# Altium schematic sheet 02_stm32_power.SchDoc: KART : STM32 POWER
size A4; DrawnBy: JNieto; DocumentNumber: 3; Revision: 1.0; SheetNumber: 3; SheetTotal: 10; Version: V 1.0.0
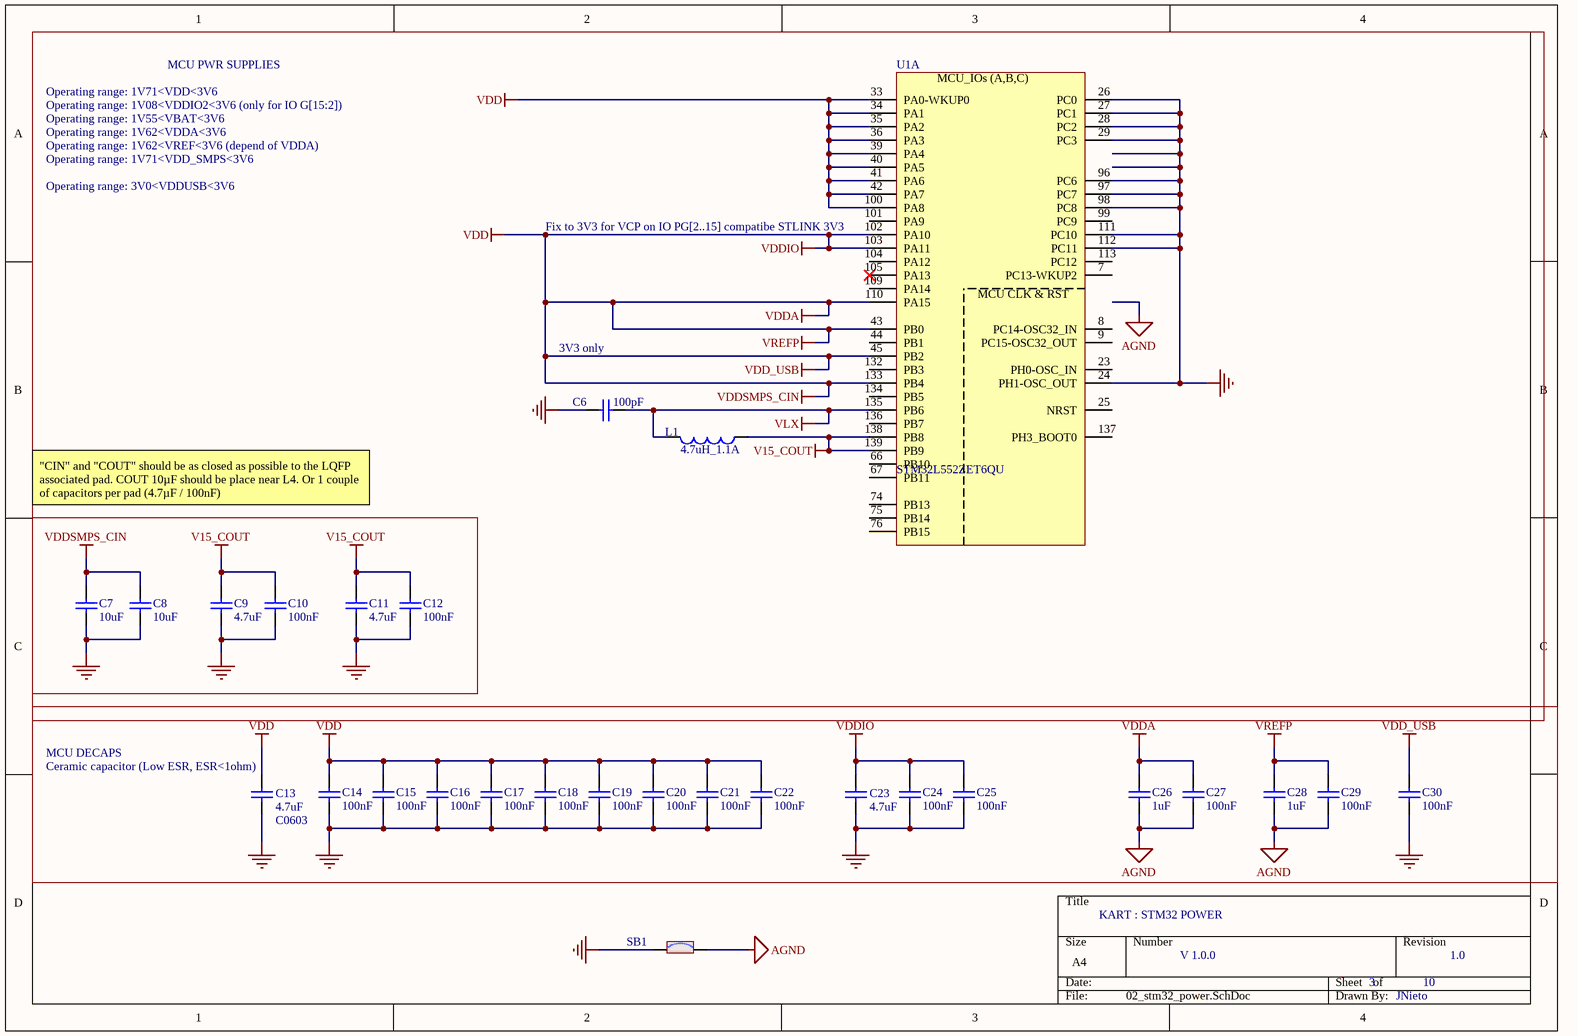
[diagram p0: 02_stm32_power.SchDoc]

## Parts
C6  value 100pF  [C0603]
C7  value 10uF  [C0603]
C8  value 10uF  [C0603]
C9  value 4.7uF  [C0603]
C10  value 100nF  [C0603]  (hidden comment: Capacitor)
C11  value 4.7uF  [C0603]
C12  value 100nF  [C0603]  (hidden comment: Capacitor)
C13  value 4.7uF  [C0603]
C14  value 100nF  [C0603]  (hidden comment: Capacitor)
C15  value 100nF  [C0603]  (hidden comment: Capacitor)
C16  value 100nF  [C0603]  (hidden comment: Capacitor)
C17  value 100nF  [C0603]  (hidden comment: Capacitor)
C18  value 100nF  [C0603]  (hidden comment: Capacitor)
C19  value 100nF  [C0603]  (hidden comment: Capacitor)
C20  value 100nF  [C0603]  (hidden comment: Capacitor)
C21  value 100nF  [C0603]  (hidden comment: Capacitor)
C22  value 100nF  [C0603]  (hidden comment: Capacitor)
C23  value 4.7uF  [C0603]
C24  value 100nF  [C0603]  (hidden comment: Capacitor)
C25  value 100nF  [C0603]  (hidden comment: Capacitor)
C26  value 1uF  [C0603]  (hidden comment: Capacitor)
C27  value 100nF  [C0603]  (hidden comment: Capacitor)
C28  value 1uF  [C0603]  (hidden comment: Capacitor)
C29  value 100nF  [C0603]  (hidden comment: Capacitor)
C30  value 100nF  [C0603]  (hidden comment: Capacitor)
L1  value 4.7uH_1.1A  [IND_TDK_MLP2016H4R7MT0S1]  (hidden comment: Inductor)
SB1  (no value)  [SOLDER-BRIDGE_R0603-0R]
U1  STM32L552ZET6QU  [ICC_LQFP144_20X20_P050]  (part A of 3)

## Nets
AGND: C26.2 C27.1 C28.2 C29.1 SB1.2
GND: C6.1 C7.1 C8.1 C9.1 C10.1 C11.1 C12.1 C13.1 C14.1 C15.1 C16.1 C17.1 C18.1 C19.1 C20.1 C21.1 C22.1 C23.1 C24.1 C25.1 C30.1 SB1.1 U1.24(PH1-OSC_OUT) U1.26(PC0) U1.27(PC1) U1.28(PC2) U1.29(PC3) U1.96(PC6) U1.97(PC7) U1.98(PC8) U1.111(PC10) U1.112(PC11)
V15_COUT: C9.2 C10.2 C11.2 C12.2 L1.1 U1.138(PB8) U1.139(PB9)
VDD: C7.2 C8.2 C13.2 C14.2 C15.2 C16.2 C17.2 C18.2 C19.2 C20.2 C21.2 C22.2 C23.2 C24.2 C25.2 C26.1 C27.2 C28.1 C29.2 C30.2 U1.33(PA0-WKUP0) U1.34(PA1) U1.35(PA2) U1.36(PA3) U1.39(PA4) U1.40(PA5) U1.41(PA6) U1.42(PA7) U1.43(PB0) U1.45(PB2) U1.100(PA8) U1.102(PA10) U1.103(PA11) U1.110(PA15) U1.133(PB4)  [also labelled VDD_USB, VDDA, VDDIO, VDDSMPS_CIN, VREFP]
VLX: C6.2 L1.2 U1.135(PB6)

Not connected (* = marked no-connect by the designer): U1 7(PC13-WKUP2) 8(PC14-OSC32_IN) 9(PC15-OSC32_OUT) 23(PH0-OSC_IN) 25(NRST) 44(PB1) 66(PB10) 67(PB11) 74(PB13) 75(PB14) 76(PB15) 99(PC9) 101(PA9) 104(PA12) 105(PA13)* 109(PA14) 113(PC12) 132(PB3) 134(PB5) 136(PB7) 137(PH3_BOOT0)

## Notes on the sheet
- Operating range: 1V71<VDD<3V6
- Operating range: 1V08<VDDIO2<3V6 (only for IO G[15:2])
- MCU PWR SUPPLIES
- Operating range: 1V62<VDDA<3V6
- Operating range: 1V55<VBAT<3V6
- Operating range: 1V71<VDD_SMPS<3V6
- Operating range: 1V62<VREF<3V6 (depend of VDDA)
- Operating range: 3V0<VDDUSB<3V6
- (near U1) Fix to 3V3 for VCP on IO PG[2..15] compatibe STLINK 3V3
- 3V3 only
- "CIN" and "COUT" should be as closed as possible to the LQFP associated pad. COUT 10µF should be place near L4. Or 1 couple of capacitors per pad (4.7µF / 100nF)
- MCU DECAPS
- (near C13) Ceramic capacitor (Low ESR, ESR<1ohm)
- (in symbol MCD-01055, part A) MCU_IOs (A,B,C); MCU CLK & RST

## Library data of the parts
C6 = MCD-00205: Capacitor, MLCC, 100pF, 50V, NPO, 5%, 0402, T=0,5mm; Manufacturer_Part_Number: CC0402JRNPO9BN101; Manufacturer: YAGEO; Provided_By: Subcon; Initial_Board_Reference: MB1361; Internal_Part_Number: MCD-00205; Status: Released; Part_Type: Capacitor; Package: C0402; ComponentLink1Description: Datasheet; ComponentLink1URL: http://tunmcdsvn.tun.st.com/Component_Datasheet_Library/Trunk/Capacitors/Yageo_Capacitor_NP0_16V-to-50V; ECCN_US: n/a; ECCN_EU: n/a
C7 C8 = MCD-01355: Capacitor, MLCC, 10uF, 4V, X5R, 20%, 0402, T=0,5mm; Manufacturer_Part_Number: GRM155R60G106ME44; Manufacturer: MURATA; ECCN_US: EAR99; ECCN_EU: NEC; Provided_By: Subcon; Initial_Board_Reference: MB1372; Internal_Part_Number: MCD-01355; Status: Checked; Part_Type: Capacitor; Package: C0402; ComponentLink1Description: Datasheet; ComponentLink1URL: http://tunmcdsvn.tun.st.com/Component_Datasheet_Library/Trunk/Capacitors/Murata_Capacitor_GR_series
C9 C11 = MCD-01356: Capacitor, MLCC, 4.7uF, 6V3, X5R, 20%, 0402, T=0,5mm; Manufacturer_Part_Number: GRM155R60J475ME47; Manufacturer: MURATA; ECCN_US: EAR99; ECCN_EU: NEC; Provided_By: Subcon; Initial_Board_Reference: MB1372; Internal_Part_Number: MCD-01356; Status: Checked; Part_Type: Capacitor; Package: C0402; ComponentLink1Description: Datasheet; ComponentLink1URL: http://tunmcdsvn.tun.st.com/Component_Datasheet_Library/Trunk/Capacitors/Murata_Capacitor_GR_series
C10 C12 C14-C22 C24 C25 C27 C29 C30 = MCD-00010: Capacitor, MLCC, 100nF, 16V, X5R, 10%, 0603, T=0,8mm; Manufacturer_Part_Number: CC0603KRX5R7BB105; Manufacturer: YAGEO; Provided_By: SUBCO; Internal_Part_Number: MCD-00010; Status: Released; Part_Type: Capacitor; Package: C0603; ComponentLink1Description: Datasheet; ComponentLink1URL: http://tunmcdsvn.tun.st.com/Component_Datasheet_Library/Trunk/Capacitors/Yageo_Multilayer_capacitor_X5R_series_100pF_to_100uF
C13 C23 = MCD-01121: Capacitor, MLCC, 4.7µF, 10V, X5R, 20%, 0603, T=0,8mm; Manufacturer_Part_Number: GRM188R61A475ME15; Manufacturer: MURATA; ECCN_US: EAR99; ECCN_EU: NEC; Provided_By: Subcon; Initial_Board_Reference: MB1361; Internal_Part_Number: MCD-01121; Status: Released; Part_Type: Capacitor; Package: C0603; ComponentLink1Description: Datasheet; ComponentLink1URL: http://tunmcdsvn.tun.st.com/Component_Datasheet_Library/Trunk/Capacitors/Murata_Capacitor_GR_series
C26 C28 = MCD-00010: Capacitor, MLCC, 1uF, 16V, X5R, 10%, 0603, T=0,8mm; Manufacturer_Part_Number: CC0603KRX5R7BB105; Manufacturer: YAGEO; Provided_By: SUBCO; Internal_Part_Number: MCD-00010; Status: Released; Part_Type: Capacitor; Package: C0603; ComponentLink1Description: Datasheet; ComponentLink1URL: http://tunmcdsvn.tun.st.com/Component_Datasheet_Library/Trunk/Capacitors/Yageo_Multilayer_capacitor_X5R_series_100pF_to_100uF
L1 = MCD-01786: Power Inductor 4.7uH 1.1A 160 mOHM 20% SMD Multilayer ferrite.; Manufacturer_Part_Number: MLP2016H4R7MT0S1; Manufacturer: TDK; Provided_By: SUBCO; Internal_Part_Number: MCD-01786; Status: Checked; Part_Type: Inductor; Package: L0806; ComponentLink1Description: Datasheet; ComponentLink1URL: http://tunmcdsvn.tun.st.com/Component_Datasheet_Library/Trunk/Inductors/TDK_Power_inductor_MLP2016_series; ECCN_US: n/a; ECCN_EU: n/a
SB1 = MCD-00071: Solder Bridge ON; Part_Type: Mechanical; Provided_By: Subcon; Initial_Board_Reference: MB1274; Internal_Part_Number: MCD-00071; ECCN_US: n/a; ECCN_EU: n/a; Status: Released; ComponentLink1Description: Datasheet
U1 = MCD-01055: STM32L552ZET6Q MCU,LQFP144 20x20, 0.5, no AES, Q for Int SMPS; Part_Type: IC; Manufacturer: STMICROELECTRONICS; BMS_Part_Number: 9175310; ECCN_US: 3A991A2; ECCN_EU: NEC; Provided_By: SUBCO with ST control; Internal_Part_Number: MCD-01055; Value: STM32L552ZET6QU; Status: Released; Manufacturer_Part_Number: STM32L552ZET6QU; Package: LQFP144; ComponentLink1Description: Datasheet; ComponentLink1URL: http://tunmcdsvn.tun.st.com/Component_Datasheet_Library/Trunk/IC/STM_STM32L552ZET6QU